# Altium project PCB_Project.PrjPcb
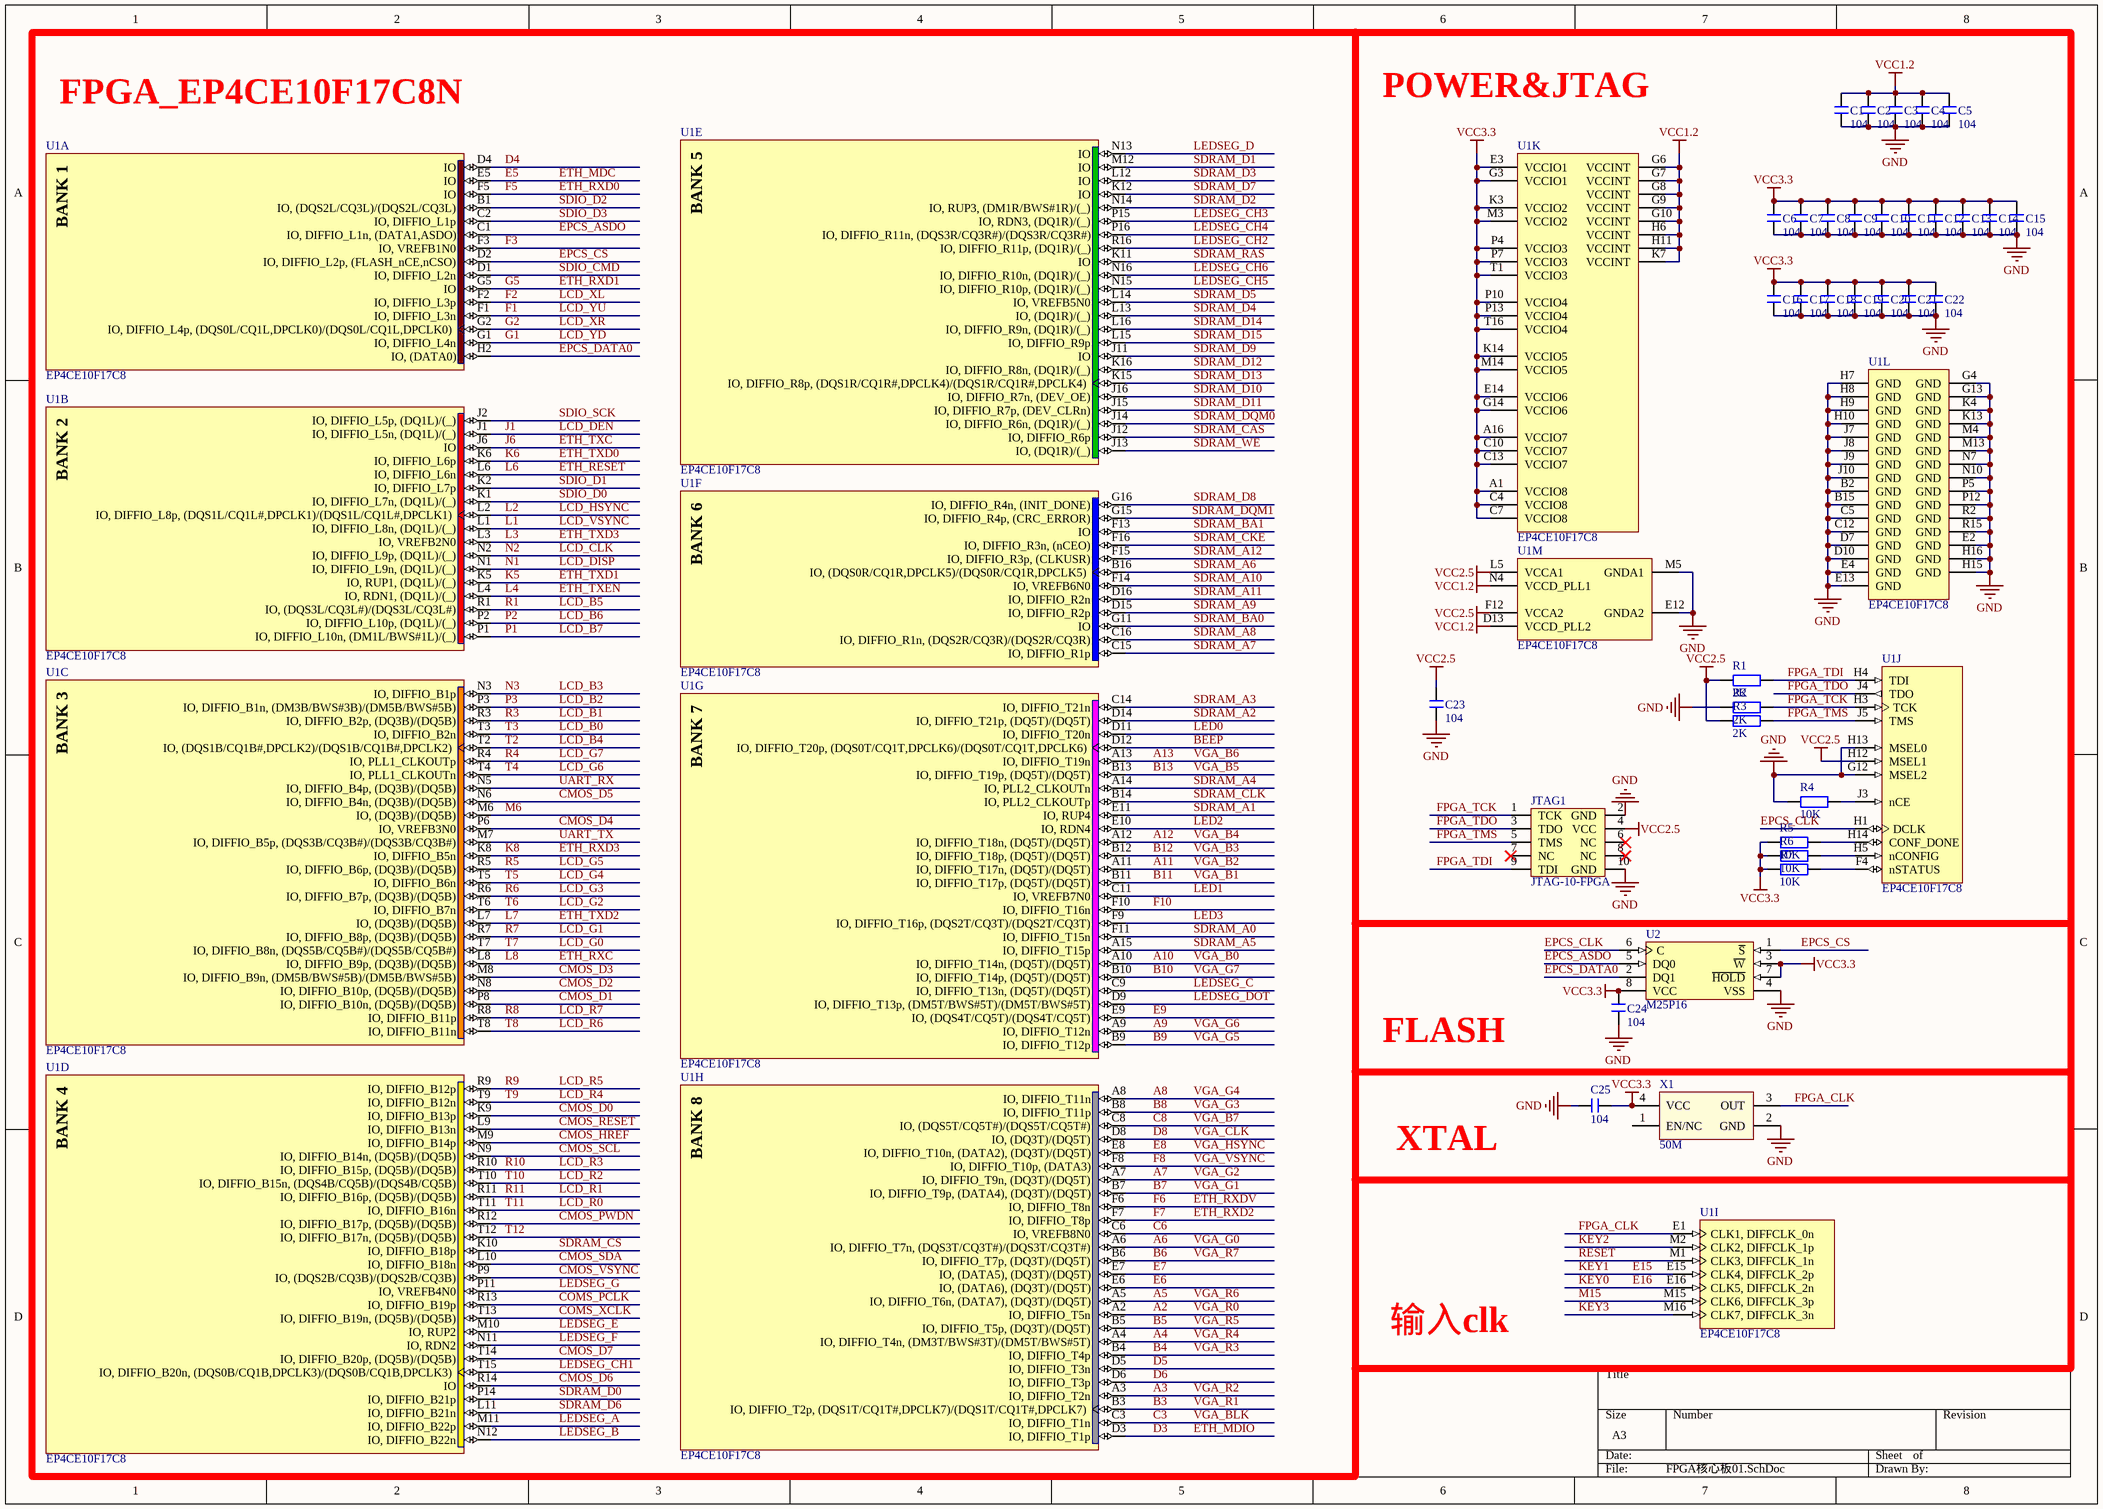
[diagram p0: FPGA核心板01.SchDoc]
4 sheets, 169 parts. Net scope: global (net labels, ports and power ports of the same name join across sheets).
Board file: FPGA核心板.PcbDoc
Sheets:
  FPGA核心板01.SchDoc
  FPGA核心板02.SchDoc
  FPGA核心板03.SchDoc
  FPGA核心板04.SchDoc

## Sheet FPGA核心板01.SchDoc
size A3

### Parts
C1  104  [C 0603_L]
C2  104  [C 0603_L]
C3  104  [C 0603_L]
C4  104  [C 0603_L]
C5  104  [C 0603_L]
C6  104  [C 0603_L]
C7  104  [C 0603_L]
C8  104  [C 0603_L]
C9  104  [C 0603_L]
C10  104  [C 0603_L]
C11  104  [C 0603_L]
C12  104  [C 0603_L]
C13  104  [C 0603_L]
C14  104  [C 0603_L]
C15  104  [C 0603_L]
C16  104  [C 0603_L]
C17  104  [C 0603_L]
C18  104  [C 0603_L]
C19  104  [C 0603_L]
C20  104  [C 0603_L]
C21  104  [C 0603_L]
C22  104  [C 0603_L]
C23  104  [C 0603_L]
C24  104  [C 0603_L]
C25  104  [C 0603_L]
JTAG1  JTAG-10-FPGA  [JTAG_10_2.54]
R1  2K  [R 0603_L]
R2  2K  [R 0603_L]
R3  2K  [R 0603_L]
R4  10K  [R 0603_L]
R5  10K  [R 0603_L]
R6  10K  [R 0603_L]
R7  10K  [R 0603_L]
U1  EP4CE10F17C8  [FBGA256]  (parts A,B,C,D,E,F,G,H,I,J,K,L,M of 13)
U2  M25P16  [sop-8]
X1  50M  [OSC 3225-4P]

### Nets
GND: C1.1 C2.1 C3.1 C4.1 C5.1 C6.1 C7.1 C8.1 C9.1 C10.1 C11.1 C12.1 C13.1 C14.1 C15.1 C16.1 C17.1 C18.1 C19.1 C20.1 C21.1 C22.1 C23.1 C24.1 C25.2 JTAG1.2(GND) JTAG1.10(GND) R2.1 R4.1 U1.B2(GND) U1.B15(GND) U1.C5(GND) U1.C12(GND) U1.D7(GND) U1.D10(GND) U1.E2(GND) U1.E4(GND) U1.E12(GNDA2) U1.E13(GND) U1.G4(GND) U1.G12(MSEL2) U1.G13(GND) U1.H7(GND) U1.H8(GND) U1.H9(GND) U1.H10(GND) U1.H13(MSEL0) U1.H15(GND) U1.H16(GND) U1.J7(GND) U1.J8(GND) U1.J9(GND) U1.J10(GND) U1.K4(GND) U1.K13(GND) U1.M4(GND) U1.M5(GNDA1) U1.M13(GND) U1.N7(GND) U1.N10(GND) U1.P5(GND) U1.P12(GND) U1.R2(GND) U1.R15(GND) U2.4(VSS) X1.2(GND)
VCC1.2: C1.2 C2.2 C3.2 C4.2 C5.2 U1.D13(VCCD_PLL2) U1.G6(VCCINT) U1.G7(VCCINT) U1.G8(VCCINT) U1.G9(VCCINT) U1.G10(VCCINT) U1.H6(VCCINT) U1.H11(VCCINT) U1.K7(VCCINT) U1.N4(VCCD_PLL1)
VCC2.5: C23.2 JTAG1.4(VCC) R1.1 R3.1 U1.F12(VCCA2) U1.H12(MSEL1) U1.L5(VCCA1)
VCC3.3: C6.2 C7.2 C8.2 C9.2 C10.2 C11.2 C12.2 C13.2 C14.2 C15.2 C16.2 C17.2 C18.2 C19.2 C20.2 C21.2 C22.2 C24.2 C25.1 R5.1 R6.1 R7.1 U1.A1(VCCIO8) U1.A16(VCCIO7) U1.C4(VCCIO8) U1.C7(VCCIO8) U1.C10(VCCIO7) U1.C13(VCCIO7) U1.E3(VCCIO1) U1.E14(VCCIO6) U1.G3(VCCIO1) U1.G14(VCCIO6) U1.K3(VCCIO2) U1.K14(VCCIO5) U1.M3(VCCIO2) U1.M14(VCCIO5) U1.P4(VCCIO3) U1.P7(VCCIO3) U1.P10(VCCIO4) U1.P13(VCCIO4) U1.T1(VCCIO3) U1.T16(VCCIO4) U2.3(~{W}) U2.7(~{HOLD}) U2.8(VCC) X1.4(VCC)
A2: U1.A2(IO,_DIFFIO_T5n)  [also labelled VGA_R0]
A3: U1.A3(IO,_DIFFIO_T2n)  [also labelled VGA_R2]
A4: U1.A4(IO,_DIFFIO_T4n,_(DM3T/BWS#3T)/(DM5T/BWS#5T))  [also labelled VGA_R4]
A5: U1.A5(IO,_DIFFIO_T6n,_(DATA7),_(DQ3T)/(DQ5T))  [also labelled VGA_R6]
A6: U1.A6(IO,_DIFFIO_T7n,_(DQS3T/CQ3T#)/(DQS3T/CQ3T#))  [also labelled VGA_G0]
A7: U1.A7(IO,_DIFFIO_T9n,_(DQ3T)/(DQ5T))  [also labelled VGA_G2]
A8: U1.A8(IO,_DIFFIO_T11n)  [also labelled VGA_G4]
A9: U1.A9(IO,_DIFFIO_T12n)  [also labelled VGA_G6]
A10: U1.A10(IO,_DIFFIO_T14n,_(DQ5T)/(DQ5T))  [also labelled VGA_B0]
A11: U1.A11(IO,_DIFFIO_T17n,_(DQ5T)/(DQ5T))  [also labelled VGA_B2]
A12: U1.A12(IO,_DIFFIO_T18n,_(DQ5T)/(DQ5T))  [also labelled VGA_B4]
A13: U1.A13(IO,_DIFFIO_T19n)  [also labelled VGA_B6]
B3: U1.B3(IO,_DIFFIO_T2p,_(DQS1T/CQ1T#,DPCLK7)/(DQS1T/CQ1T#,DPCLK7))  [also labelled VGA_R1]
B4: U1.B4(IO,_DIFFIO_T4p)  [also labelled VGA_R3]
B5: U1.B5(IO,_DIFFIO_T5p,_(DQ3T)/(DQ5T))  [also labelled VGA_R5]
B6: U1.B6(IO,_DIFFIO_T7p,_(DQ3T)/(DQ5T))  [also labelled VGA_R7]
B7: U1.B7(IO,_DIFFIO_T9p,_(DATA4),_(DQ3T)/(DQ5T))  [also labelled VGA_G1]
B8: U1.B8(IO,_DIFFIO_T11p)  [also labelled VGA_G3]
B9: U1.B9(IO,_DIFFIO_T12p)  [also labelled VGA_G5]
B10: U1.B10(IO,_DIFFIO_T14p,_(DQ5T)/(DQ5T))  [also labelled VGA_G7]
B11: U1.B11(IO,_DIFFIO_T17p,_(DQ5T)/(DQ5T))  [also labelled VGA_B1]
B12: U1.B12(IO,_DIFFIO_T18p,_(DQ5T)/(DQ5T))  [also labelled VGA_B3]
B13: U1.B13(IO,_DIFFIO_T19p,_(DQ5T)/(DQ5T))  [also labelled VGA_B5]
BEEP: U1.D12(IO,_DIFFIO_T20p,_(DQS0T/CQ1T,DPCLK6)/(DQS0T/CQ1T,DPCLK6))
C3: U1.C3(IO,_DIFFIO_T1n)  [also labelled VGA_BLK]
C6: U1.C6(IO,_VREFB8N0)
C8: U1.C8(IO,_(DQS5T/CQ5T#)/(DQS5T/CQ5T#))  [also labelled VGA_B7]
CMOS_D0: U1.K9(IO,_DIFFIO_B13p)
CMOS_D1: U1.P8(IO,_DIFFIO_B10n,_(DQ5B)/(DQ5B))
CMOS_D2: U1.N8(IO,_DIFFIO_B10p,_(DQ5B)/(DQ5B))
CMOS_D3: U1.M8(IO,_DIFFIO_B9n,_(DM5B/BWS#5B)/(DM5B/BWS#5B))
CMOS_D4: U1.P6(IO,_VREFB3N0)
CMOS_D5: U1.N6(IO,_DIFFIO_B4n,_(DQ3B)/(DQ5B))
CMOS_D6: U1.R14(IO)
CMOS_D7: U1.T14(IO,_DIFFIO_B20p,_(DQ5B)/(DQ5B))
CMOS_HREF: U1.M9(IO,_DIFFIO_B14p)
CMOS_PWDN: U1.R12(IO,_DIFFIO_B17p,_(DQ5B)/(DQ5B))
CMOS_RESET: U1.L9(IO,_DIFFIO_B13n)
CMOS_SCL: U1.N9(IO,_DIFFIO_B14n,_(DQ5B)/(DQ5B))
CMOS_SDA: U1.L10(IO,_DIFFIO_B18n)
CMOS_VSYNC: U1.P9(IO,_(DQS2B/CQ3B)/(DQS2B/CQ3B))
COMS_PCLK: U1.R13(IO,_DIFFIO_B19p)
COMS_XCLK: U1.T13(IO,_DIFFIO_B19n,_(DQ5B)/(DQ5B))
D3: U1.D3(IO,_DIFFIO_T1p)  [also labelled ETH_MDIO]
D4: U1.D4(IO)
D5: U1.D5(IO,_DIFFIO_T3n)
D6: U1.D6(IO,_DIFFIO_T3p)
D8: U1.D8(IO,_(DQ3T)/(DQ5T))  [also labelled VGA_CLK]
E5: U1.E5(IO)  [also labelled ETH_MDC]
E6: U1.E6(IO,_(DATA6),_(DQ3T)/(DQ5T))
E7: U1.E7(IO,_(DATA5),_(DQ3T)/(DQ5T))
E8: U1.E8(IO,_DIFFIO_T10n,_(DATA2),_(DQ3T)/(DQ5T))  [also labelled VGA_HSYNC]
E9: U1.E9(IO,_(DQS4T/CQ5T)/(DQS4T/CQ5T))
E15: U1.E15(CLK4,_DIFFCLK_2p)  [also labelled KEY1]
E16: U1.E16(CLK5,_DIFFCLK_2n)  [also labelled KEY0]
EPCS_ASDO: U1.C1(IO,_DIFFIO_L1n,_(DATA1,ASDO)) U2.5(DQ0)
EPCS_CLK: U1.H1(DCLK) U2.6(C)
EPCS_CS: U1.D2(IO,_DIFFIO_L2p,_(FLASH_nCE,nCSO)) U2.1(~{S})
EPCS_DATA0: U1.H2(IO,_(DATA0)) U2.2(DQ1)
ETH_RESET: U1.L6(IO,_DIFFIO_L6n)  [also labelled L6]
ETH_RXC: U1.L8(IO,_DIFFIO_B9p,_(DQ3B)/(DQ5B))  [also labelled L8]
ETH_RXD0: U1.F5(IO)  [also labelled F5]
ETH_RXD1: U1.G5(IO)  [also labelled G5]
ETH_RXD2: U1.F7(IO,_DIFFIO_T8p)  [also labelled F7]
ETH_RXD3: U1.K8(IO,_DIFFIO_B5n)  [also labelled K8]
ETH_RXDV: U1.F6(IO,_DIFFIO_T8n)  [also labelled F6]
ETH_TXC: U1.J6(IO)  [also labelled J6]
ETH_TXD0: U1.K6(IO,_DIFFIO_L6p)  [also labelled K6]
ETH_TXD1: U1.K5(IO,_RUP1,_(DQ1L)/(_))  [also labelled K5]
ETH_TXD2: U1.L7(IO,_(DQ3B)/(DQ5B))  [also labelled L7]
ETH_TXD3: U1.L3(IO,_VREFB2N0)  [also labelled L3]
ETH_TXEN: U1.L4(IO,_RDN1,_(DQ1L)/(_))  [also labelled L4]
F1: U1.F1(IO,_DIFFIO_L3n)  [also labelled LCD_YU]
F2: U1.F2(IO,_DIFFIO_L3p)  [also labelled LCD_XL]
F3: U1.F3(IO,_VREFB1N0)
F8: U1.F8(IO,_DIFFIO_T10p,_(DATA3))  [also labelled VGA_VSYNC]
F10: U1.F10(IO,_DIFFIO_T16n)
FPGA_CLK: U1.E1(CLK1,_DIFFCLK_0n) X1.3(OUT)
FPGA_TCK: JTAG1.1(TCK) R2.2 U1.H3(TCK)
FPGA_TDI: JTAG1.9(TDI) R1.2 U1.H4(TDI)
FPGA_TDO: JTAG1.3(TDO) U1.J4(TDO)
FPGA_TMS: JTAG1.5(TMS) R3.2 U1.J5(TMS)
G1: U1.G1(IO,_DIFFIO_L4n)  [also labelled LCD_YD]
G2: U1.G2(IO,_DIFFIO_L4p,_(DQS0L/CQ1L,DPCLK0)/(DQS0L/CQ1L,DPCLK0))  [also labelled LCD_XR]
J1: U1.J1(IO,_DIFFIO_L5n,_(DQ1L)/(_))  [also labelled LCD_DEN]
KEY2: U1.M2(CLK2,_DIFFCLK_1p)
KEY3: U1.M16(CLK7,_DIFFCLK_3n)
L1: U1.L1(IO,_DIFFIO_L8n,_(DQ1L)/(_))  [also labelled LCD_VSYNC]
L2: U1.L2(IO,_DIFFIO_L8p,_(DQS1L/CQ1L#,DPCLK1)/(DQS1L/CQ1L#,DPCLK1))  [also labelled LCD_HSYNC]
LCD_B0: U1.T3(IO,_DIFFIO_B2n)  [also labelled T3]
LCD_B1: U1.R3(IO,_DIFFIO_B2p,_(DQ3B)/(DQ5B))  [also labelled R3]
LCD_B2: U1.P3(IO,_DIFFIO_B1n,_(DM3B/BWS#3B)/(DM5B/BWS#5B))  [also labelled P3]
LCD_B3: U1.N3(IO,_DIFFIO_B1p)  [also labelled N3]
LCD_B4: U1.T2(IO,_(DQS1B/CQ1B#,DPCLK2)/(DQS1B/CQ1B#,DPCLK2))  [also labelled T2]
LCD_B5: U1.R1(IO,_(DQS3L/CQ3L#)/(DQS3L/CQ3L#))  [also labelled R1]
LCD_B6: U1.P2(IO,_DIFFIO_L10p,_(DQ1L)/(_))  [also labelled P2]
LCD_B7: U1.P1(IO,_DIFFIO_L10n,_(DM1L/BWS#1L)/(_))  [also labelled P1]
LCD_CLK: U1.N2(IO,_DIFFIO_L9p,_(DQ1L)/(_))  [also labelled N2]
LCD_DISP: U1.N1(IO,_DIFFIO_L9n,_(DQ1L)/(_))  [also labelled N1]
LCD_G0: U1.T7(IO,_DIFFIO_B8n,_(DQS5B/CQ5B#)/(DQS5B/CQ5B#))  [also labelled T7]
LCD_G1: U1.R7(IO,_DIFFIO_B8p,_(DQ3B)/(DQ5B))  [also labelled R7]
LCD_G2: U1.T6(IO,_DIFFIO_B7n)  [also labelled T6]
LCD_G3: U1.R6(IO,_DIFFIO_B7p,_(DQ3B)/(DQ5B))  [also labelled R6]
LCD_G4: U1.T5(IO,_DIFFIO_B6n)  [also labelled T5]
LCD_G5: U1.R5(IO,_DIFFIO_B6p,_(DQ3B)/(DQ5B))  [also labelled R5]
LCD_G6: U1.T4(IO,_PLL1_CLKOUTn)  [also labelled T4]
LCD_G7: U1.R4(IO,_PLL1_CLKOUTp)  [also labelled R4]
LCD_R0: U1.T11(IO,_DIFFIO_B16n)  [also labelled T11]
LCD_R1: U1.R11(IO,_DIFFIO_B16p,_(DQ5B)/(DQ5B))  [also labelled R11]
LCD_R2: U1.T10(IO,_DIFFIO_B15n,_(DQS4B/CQ5B)/(DQS4B/CQ5B))  [also labelled T10]
LCD_R3: U1.R10(IO,_DIFFIO_B15p,_(DQ5B)/(DQ5B))  [also labelled R10]
LCD_R4: U1.T9(IO,_DIFFIO_B12n)  [also labelled T9]
LCD_R5: U1.R9(IO,_DIFFIO_B12p)  [also labelled R9]
LCD_R6: U1.T8(IO,_DIFFIO_B11n)  [also labelled T8]
LCD_R7: U1.R8(IO,_DIFFIO_B11p)  [also labelled R8]
LED0: U1.D11(IO,_DIFFIO_T20n)
LED1: U1.C11(IO,_VREFB7N0)
LED2: U1.E10(IO,_RDN4)
LED3: U1.F9(IO,_DIFFIO_T16p,_(DQS2T/CQ3T)/(DQS2T/CQ3T))
LEDSEG_A: U1.M11(IO,_DIFFIO_B22p)
LEDSEG_B: U1.N12(IO,_DIFFIO_B22n)
LEDSEG_C: U1.C9(IO,_DIFFIO_T13n,_(DQ5T)/(DQ5T))
LEDSEG_CH1: U1.T15(IO,_DIFFIO_B20n,_(DQS0B/CQ1B,DPCLK3)/(DQS0B/CQ1B,DPCLK3))
LEDSEG_CH2: U1.R16(IO,_DIFFIO_R11p,_(DQ1R)/(_))
LEDSEG_CH3: U1.P15(IO,_RDN3,_(DQ1R)/(_))
LEDSEG_CH4: U1.P16(IO,_DIFFIO_R11n,_(DQS3R/CQ3R#)/(DQS3R/CQ3R#))
LEDSEG_CH5: U1.N15(IO,_DIFFIO_R10p,_(DQ1R)/(_))
LEDSEG_CH6: U1.N16(IO,_DIFFIO_R10n,_(DQ1R)/(_))
LEDSEG_D: U1.N13(IO)
LEDSEG_DOT: U1.D9(IO,_DIFFIO_T13p,_(DM5T/BWS#5T)/(DM5T/BWS#5T))
LEDSEG_E: U1.M10(IO,_RUP2)
LEDSEG_F: U1.N11(IO,_RDN2)
LEDSEG_G: U1.P11(IO,_VREFB4N0)
M6: U1.M6(IO,_(DQ3B)/(DQ5B))
M15: U1.M15(CLK6,_DIFFCLK_3p)
RESET: U1.M1(CLK3,_DIFFCLK_1n)
SDIO_CMD: U1.D1(IO,_DIFFIO_L2n)
SDIO_D0: U1.K1(IO,_DIFFIO_L7n,_(DQ1L)/(_))
SDIO_D1: U1.K2(IO,_DIFFIO_L7p)
SDIO_D2: U1.B1(IO,_(DQS2L/CQ3L)/(DQS2L/CQ3L))
SDIO_D3: U1.C2(IO,_DIFFIO_L1p)
SDIO_SCK: U1.J2(IO,_DIFFIO_L5p,_(DQ1L)/(_))
SDRAM_A0: U1.F11(IO,_DIFFIO_T15n)
SDRAM_A1: U1.E11(IO,_RUP4)
SDRAM_A2: U1.D14(IO,_DIFFIO_T21p,_(DQ5T)/(DQ5T))
SDRAM_A3: U1.C14(IO,_DIFFIO_T21n)
SDRAM_A4: U1.A14(IO,_PLL2_CLKOUTn)
SDRAM_A5: U1.A15(IO,_DIFFIO_T15p)
SDRAM_A6: U1.B16(IO,_(DQS0R/CQ1R,DPCLK5)/(DQS0R/CQ1R,DPCLK5))
SDRAM_A7: U1.C15(IO,_DIFFIO_R1p)
SDRAM_A8: U1.C16(IO,_DIFFIO_R1n,_(DQS2R/CQ3R)/(DQS2R/CQ3R))
SDRAM_A9: U1.D15(IO,_DIFFIO_R2p)
SDRAM_A10: U1.F14(IO,_VREFB6N0)
SDRAM_A11: U1.D16(IO,_DIFFIO_R2n)
SDRAM_A12: U1.F15(IO,_DIFFIO_R3p,_(CLKUSR))
SDRAM_BA0: U1.G11(IO)
SDRAM_BA1: U1.F13(IO)
SDRAM_CAS: U1.J12(IO,_DIFFIO_R6p)
SDRAM_CKE: U1.F16(IO,_DIFFIO_R3n,_(nCEO))
SDRAM_CLK: U1.B14(IO,_PLL2_CLKOUTp)
SDRAM_CS: U1.K10(IO,_DIFFIO_B18p)
SDRAM_D0: U1.P14(IO,_DIFFIO_B21p)
SDRAM_D1: U1.M12(IO)
SDRAM_D2: U1.N14(IO,_RUP3,_(DM1R/BWS#1R)/(_))
SDRAM_D3: U1.L12(IO)
SDRAM_D4: U1.L13(IO,_(DQ1R)/(_))
SDRAM_D5: U1.L14(IO,_VREFB5N0)
SDRAM_D6: U1.L11(IO,_DIFFIO_B21n)
SDRAM_D7: U1.K12(IO)
SDRAM_D8: U1.G16(IO,_DIFFIO_R4n,_(INIT_DONE))
SDRAM_D9: U1.J11(IO)
SDRAM_D10: U1.J16(IO,_DIFFIO_R7n,_(DEV_OE))
SDRAM_D11: U1.J15(IO,_DIFFIO_R7p,_(DEV_CLRn))
SDRAM_D12: U1.K16(IO,_DIFFIO_R8n,_(DQ1R)/(_))
SDRAM_D13: U1.K15(IO,_DIFFIO_R8p,_(DQS1R/CQ1R#,DPCLK4)/(DQS1R/CQ1R#,DPCLK4))
SDRAM_D14: U1.L16(IO,_DIFFIO_R9n,_(DQ1R)/(_))
SDRAM_D15: U1.L15(IO,_DIFFIO_R9p)
SDRAM_DQM0: U1.J14(IO,_DIFFIO_R6n,_(DQ1R)/(_))
SDRAM_DQM1: U1.G15(IO,_DIFFIO_R4p,_(CRC_ERROR))
SDRAM_RAS: U1.K11(IO)
SDRAM_WE: U1.J13(IO,_(DQ1R)/(_))
T12: U1.T12(IO,_DIFFIO_B17n,_(DQ5B)/(DQ5B))
UART_RX: U1.N5(IO,_DIFFIO_B4p,_(DQ3B)/(DQ5B))
UART_TX: U1.M7(IO,_DIFFIO_B5p,_(DQS3B/CQ3B#)/(DQS3B/CQ3B#))
NetR4_2: R4.2 U1.J3(nCE)
NetR5_2: R5.2 U1.H14(CONF_DONE)
NetR6_2: R6.2 U1.H5(nCONFIG)
NetR7_2: R7.2 U1.F4(nSTATUS)

Not connected (* = marked no-connect by the designer): JTAG1 6(NC)* 7(NC)* 8(NC)*; X1 1(EN/NC)

### Notes on the sheet
- FPGA_EP4CE10F17C8N
- POWER&JTAG
- FLASH
- XTAL
- 输入clk
- (in symbol EP4CE6F17C8, part A) BANK 1
- (in symbol EP4CE6F17C8, part B) BANK 2
- (in symbol EP4CE6F17C8, part C) BANK 3
- (in symbol EP4CE6F17C8, part D) BANK 4
- (in symbol EP4CE6F17C8, part E) BANK 5
- (in symbol EP4CE6F17C8, part F) BANK 6
- (in symbol EP4CE6F17C8, part G) BANK 7
- (in symbol EP4CE6F17C8, part H) BANK 8

### Library data of the parts
C1-C25 = C: 贴片电容; BOM名称: 无极性贴片电容; 淘宝ID: 封装库来自淘宝 ID：黄晶宝石; 联系售后: https://shop463601444.taobao.com
R1-R7 = R: 贴片电阻; 版权归属: 来自淘宝 ID：黄晶宝石; BOM名称: 贴片电阻; 联系售后: https://shop463601444.taobao.com
U1 = EP4CE6F17C8: Cyclone IV Family FPGA, 2V Core, 179 I/O Pins, 2 PLLs, 256-Pin FBGA, Speed Grade 8, Commercial Grade; Published: 3-May-2010; DatasheetVersion: ver1.2, Mar-2010; PackageVersion: ver16.0, Dec-2009; PackageReference: FBGA256; Publisher: Altium Limited; PackageDescription: 256-Ball FineLine Ball Grid Array (FBGA256) - Option 1 - Wire Bond; Supplier 1: Digi-Key; Supplier Part Number 1: EP4CE6F17C8-ND; Code_JEDEC: MS-034-AAF-1; Code_IPC: BGA100P16X16-256; ComponentLink1Description: Manufacturer Link; ComponentLink1URL: http://www.altera.com/; ComponentLink2Description: Handbook; ComponentLink2URL: http://www.altera.com/literature/hb/cyclone-iv/cyclone4-handbook.pdf; ComponentLink3Description: Pinout Specification; ComponentLink3URL: http://www.altera.com/literature/lit-dp.jsp?category=cyc%204&showspreadsheet=y; ComponentLink4Description: Packaging Specification; ComponentLink4URL: http://www.altera.com/literature/ds/dspkg.pdf
U2 = M25P16: 16 Mb (x1) Automotive Serial NOR Flash Memory, 75 MHz, 2.7 to 3.6 V, 8-pin SO8; Part Family: M25P爭ISHIDDEN=T|; Manufacturer: Micron; PartNumber: M25P16-VMN3PB; Density: 16Mb爭ISHIDDEN=T|; Speed: 75 MHz爭ISHIDDEN=T|; Voltage: 2.7V-3.6V爭ISHIDDEN=T|; DatasheetVersion: Rev. Y; PackageVersion: Rev 11; PackageReference: MICT-MN-8; PackageDescription: 8-Pin SO Narrow, 3.9 X 4.9 mm, Pitch 1.27 mm; Applications: Automotive爭ISHIDDEN=T|; Package: SO8 Narrow爭ISHIDDEN=T|; Part Status: Production爭ISHIDDEN=T|; RoHS: Yes爭ISHIDDEN=T|; Type: Data Storage爭ISHIDDEN=T|; Width: x1爭ISHIDDEN=T|; Mounting Technology: Surface Mount; ComponentLink1Description: Manufacturer URL; ComponentLink1URL: http://www.micron.com/; ComponentLink2Description: Datasheet; ComponentLink2URL: http://www.micron.com/~/media/Documents/Products/Data%20Sheet/NOR%20Flash/Serial%20NOR/M25P/M25P16.pdf; ComponentLink3Description: Package Specification; ComponentLink3URL: http://www.micron.com/~/media/Documents/Products/Data%20Sheet/NOR%20Flash/Serial%20NOR/M25P/M25P05A.pdf
X1 = XTAL-ACT-4P: 4脚有源晶振; 版权归属: 源创客; BOM名称: 4脚有源晶振; 学习资源: www.ooocke.com

## Sheet FPGA核心板02.SchDoc
size A4
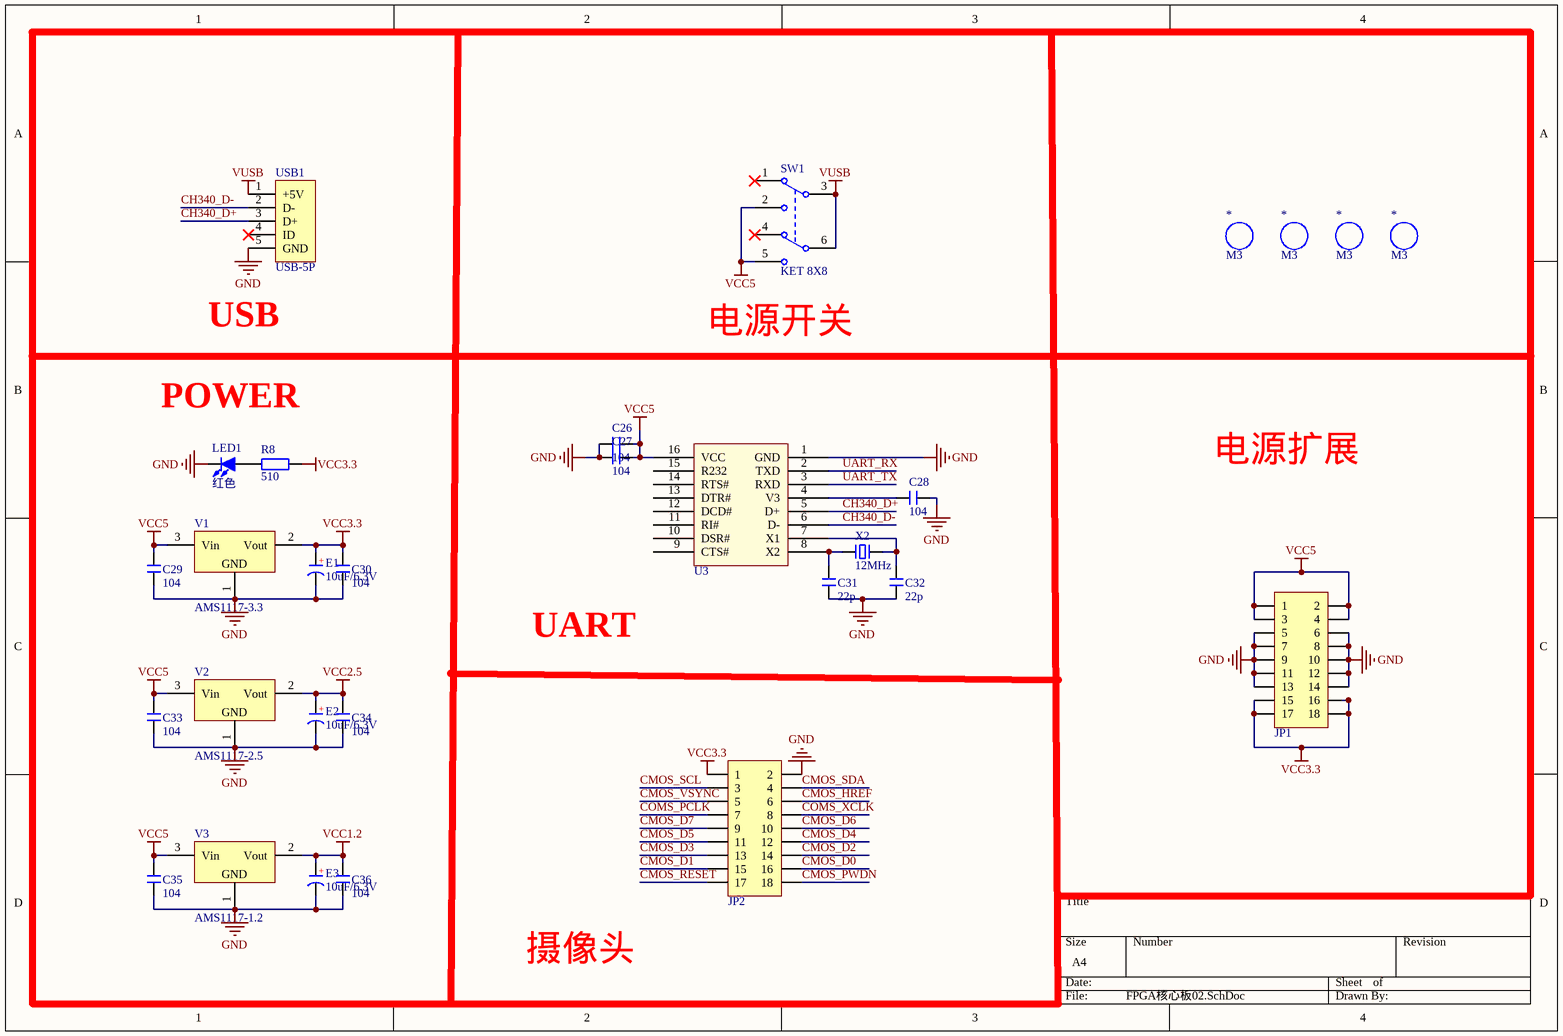
[diagram p1: FPGA核心板02.SchDoc]

### Parts
(Parts that share a designator on the sheet are numbered #1, #2 ... from top to bottom, then left to right.)
*#1  M3  [M3 125X300]
*#2  M3  [M3 125X300]
*#3  M3  [M3 125X300]
*#4  M3  [M3 125X300]
C26  104  [C 0603_L]
C27  104  [C 0603_L]
C28  104  [C 0603_L]
C29  104  [C 0603_L]
C30  104  [C 0603_L]
C31  22p  [C 0603_L]
C32  22p  [C 0603_L]
C33  104  [C 0603_L]
C34  104  [C 0603_L]
C35  104  [C 0603_L]
C36  104  [C 0603_L]
E1  10uF/6.3V  [CD A(3216)]
E2  10uF/6.3V  [CD A(3216)]
E3  10uF/6.3V  [CD A(3216)]
JP1  Header 9X2  [HDR2.54-LI-2x9P]  (value not drawn)
JP2  Header 9X2  [HDR2.54-WI-2x9P]  (value not drawn)
LED1  红色  [LED 0805B]
R8  510  [R 0603_L]
SW1  KET 8X8  [KFT DIP-8X8]
U3  CH340G  [sop16_L]  (value not drawn)
USB1  USB-5P  [USB-MICRO_B]
V1  AMS1117-3.3  [SOT223_L]
V2  AMS1117-2.5  [SOT223_L]
V3  AMS1117-1.2  [SOT223_L]
X2  12MHz  [OSC HC-49S]

### Nets
GND: C26.1 C27.1 C28.2 C29.2 C30.2 C31.1 C32.1 C33.2 C34.2 C35.1 C36.1 E1.2(K) E2.2(K) E3.2(K) JP1.5 JP1.6 JP1.7 JP1.8 JP1.9 JP1.10 JP1.11 JP1.12 JP1.13 JP1.14 JP2.2 LED1.2(K) U3.1(GND) USB1.5(GND) V1.1(GND) V2.1(GND) V3.1(GND)
VCC1.2: C36.2 E3.1(A) V3.2(Vout)
VCC2.5: C34.1 E2.1(A) V2.2(Vout)
VCC3.3: C30.1 E1.1(A) JP1.15 JP1.16 JP1.17 JP1.18 JP2.1 R8.2 V1.2(Vout)
VCC5: C26.2 C27.2 C29.1 C33.1 C35.2 JP1.1 JP1.2 JP1.3 JP1.4 SW1.2(COM2) SW1.5(COM2) U3.16(VCC) V1.3(Vin) V2.3(Vin) V3.3(Vin)
VUSB: SW1.3(NO1) SW1.6(NC2) USB1.1(+5V)
CH340_D+: U3.5(D+) USB1.3(D+)
CH340_D-: U3.6(D-) USB1.2(D-)
CMOS_D0: JP2.16
CMOS_D1: JP2.15
CMOS_D2: JP2.14
CMOS_D3: JP2.13
CMOS_D4: JP2.12
CMOS_D5: JP2.11
CMOS_D6: JP2.10
CMOS_D7: JP2.9
CMOS_HREF: JP2.6
CMOS_PWDN: JP2.18
CMOS_RESET: JP2.17
CMOS_SCL: JP2.3
CMOS_SDA: JP2.4
CMOS_VSYNC: JP2.5
COMS_PCLK: JP2.7
COMS_XCLK: JP2.8
UART_RX: U3.2(TXD)
UART_TX: U3.3(RXD)
NetC28_1: C28.1 U3.4(V3)
NetC31_2: C31.2 U3.8(X2) X2.1
NetC32_2: C32.2 U3.7(X1) X2.2
NetLED1_1: LED1.1(A) R8.1

Not connected (* = marked no-connect by the designer): SW1 1(NC1)* 4(NO2)*; U3 9(CTS#) 10(DSR#) 11(RI#) 12(DCD#) 13(DTR#) 14(RTS#) 15(R232); USB1 4(ID)*

### Notes on the sheet
- (near USB1) USB
- (near SW1) 电源开关
- POWER
- 电源扩展
- UART
- 摄像头
- (in symbol CT) +

### Library data of the parts
*#1-*#4 = M3: 铜柱孔; 版权归属: 封装库来自淘宝 ID：黄晶宝石; BOM名称: 铜柱孔; 学习资源: https://shop463601444.taobao.com
C26-C36 = C: as C1 on sheet FPGA核心板01; 联系售后: https://shop463601444.taobao.com
E1-E3 = CT: 贴片钽电容; 淘宝ID: 封装库来自淘宝 ID：黄晶宝石; BOM名称: 贴片钽电容; 联系售后: https://shop463601444.taobao.com
JP1 JP2 = Header 9X2: 9*2P接插件; 版权归属: 源创客; BOM名称: 9*2P接插件; 学习资源: www.ooocke.com
LED1 = LED-SMD: 贴片LED; 版权归属: 封装库来自淘宝 ID：黄晶宝石; BOM名称: 贴片LED; 学习资源: https://shop463601444.taobao.com
R8 = R: 贴片电阻; 版权归属: 来自淘宝 ID：黄晶宝石; BOM名称: 贴片电阻; 联系售后: https://shop463601444.taobao.com
SW1 = KET 8X8: 8*8自锁开关; 版权归属: 封装库来自淘宝 ID：黄晶宝石; BOM名称: 8*8自锁开关; 学习资源: https://shop463601444.taobao.com
USB1 = USB-5P: 微型USB母座; BOM名称: 微型USB母座; 学习资源: https://shop463601444.taobao.com
V1-V3 = AMS1117: 三端稳压芯片; BOM名称: 稳压芯片; 淘宝ID: 封装库来自淘宝 ID：黄晶宝石; 欢迎光临淘宝店铺: https://shop463601444.taobao.com
X2 = XTAL-2P: 2脚无源脚晶振; 版权归属: 源创客; BOM名称: 2脚无源脚晶振; 学习资源: www.ooocke.com

## Sheet FPGA核心板03.SchDoc
size A4
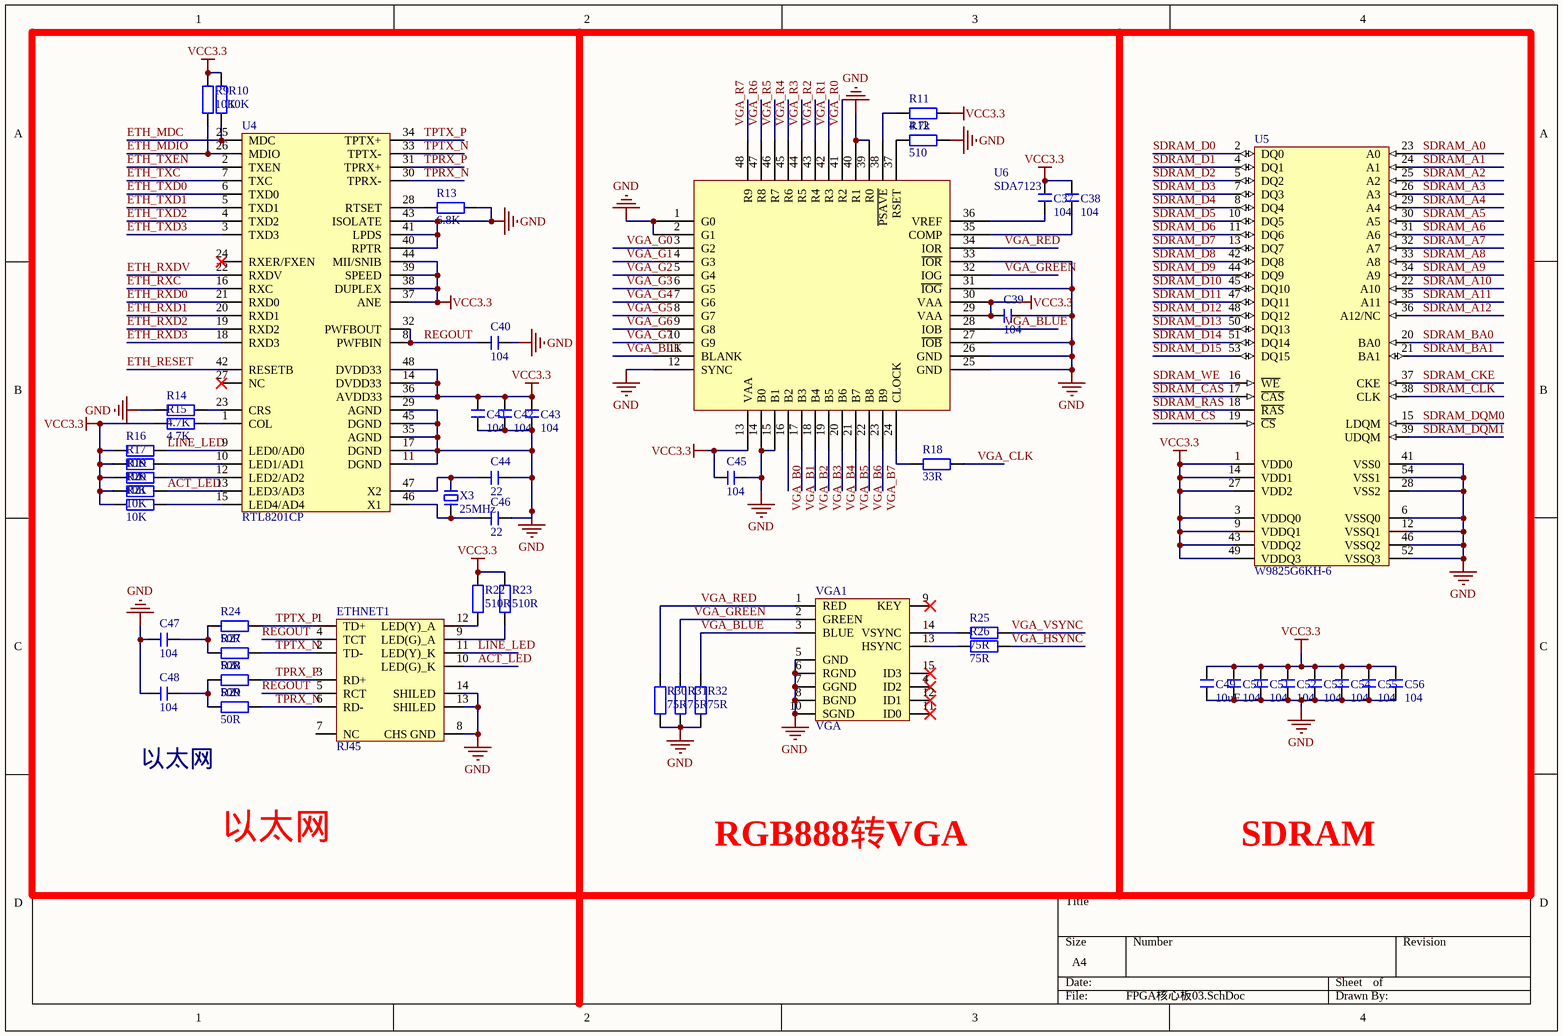
[diagram p2: FPGA核心板03.SchDoc]

### Parts
C37  104  [C 0603_L]
C38  104  [C 0603_L]
C39  104  [C 0603_L]
C40  104  [C 0603_L]
C41  104  [C 0603_L]
C42  104  [C 0603_L]
C43  104  [C 0603_L]
C44  22  [C 0603_L]
C45  104  [C 0603_L]
C46  22  [C 0603_L]
C47  104  [C 0603_L]
C48  104  [C 0603_L]
C49  10uF  [C 0603_L]
C50  104  [C 0603_L]
C51  104  [C 0603_L]
C52  104  [C 0603_L]
C53  104  [C 0603_L]
C54  104  [C 0603_L]
C55  104  [C 0603_L]
C56  104  [C 0603_L]
ETHNET1  RJ45  [RJ-45A12]
R9  10K  [R 0603_L]
R10  10K  [R 0603_L]
R11  4.7k  [R 0603_L]
R12  510  [R 0603_L]
R13  6.8K  [R 0603_L]
R14  4.7K  [R 0603_L]
R15  4.7K  [R 0603_L]
R16  10K  [R 0603_L]
R17  10K  [R 0603_L]
R18  33R  [R 0603_L]
R19  10K  [R 0603_L]
R20  10K  [R 0603_L]
R21  10K  [R 0603_L]
R22  510R  [R 0603_L]
R23  510R  [R 0603_L]
R24  50R  [R 0603_L]
R25  75R  [R 0603_L]
R26  75R  [R 0603_L]
R27  50R  [R 0603_L]
R28  50R  [R 0603_L]
R29  50R  [R 0603_L]
R30  75R  [R 0603_L]
R31  75R  [R 0603_L]
R32  75R  [R 0603_L]
U4  RTL8201CP  [LQFP48 7X7_L]
U5  W9825G6KH-6  [TSOP54]
U6  SDA7123  [LQFP48 7X7_N]
VGA1  VGA  [VGA15B]
X3  25MHz  [OSC HC-49S]

### Nets
GND: C39.1 C40.1 C41.1 C42.1 C43.1 C44.2 C45.2 C46.2 C47.2 C48.2 C49.1 C50.1 C51.1 C52.1 C53.1 C54.1 C55.1 C56.1 ETHNET1.8(CHS_GND) ETHNET1.13(SHILED) ETHNET1.14(SHILED) R12.2 R13.2 R14.1 R30.1 R31.1 R32.1 U4.11(DGND) U4.17(DGND) U4.29(AGND) U4.35(AGND) U4.40(RPTR) U4.41(LPDS) U4.43(ISOLATE) U4.45(DGND) U5.6(VSSQ0) U5.12(VSSQ1) U5.28(VSS2) U5.41(VSS0) U5.46(VSSQ2) U5.52(VSSQ3) U5.54(VSS1) U6.1(G0) U6.2(G1) U6.12(SYNC) U6.14(B0) U6.15(B1) U6.25(GND) U6.26(GND) U6.27(~{IOB}) U6.31(~{IOG}) U6.33(~{IOR}) U6.39(R0) U6.40(R1) VGA1.5(GND) VGA1.6(RGND) VGA1.7(GGND) VGA1.8(BGND) VGA1.10(SGND)
VCC3.3: C37.2 C38.2 C39.2 C41.2 C42.2 C43.2 C45.1 C49.2 C50.2 C51.2 C52.2 C53.2 C54.2 C55.2 C56.2 R9.2 R10.2 R11.2 R15.1 R16.1 R17.1 R19.1 R20.1 R21.1 R22.2 R23.2 U4.14(DVDD33) U4.36(AVDD33) U4.37(ANE) U4.38(DUPLEX) U4.39(SPEED) U4.44(MII/SNIB) U4.48(DVDD33) U5.1(VDD0) U5.3(VDDQ0) U5.9(VDDQ1) U5.14(VDD1) U5.27(VDD2) U5.43(VDDQ2) U5.49(VDDQ3) U6.13(VAA) U6.29(VAA) U6.30(VAA)
ACT_LED: ETHNET1.10(LED(G)_K) R20.2 U4.13(LED3/AD3)
ETH_MDC: R10.1 U4.25(MDC)  [project net E5]
ETH_MDIO: R9.1 U4.26(MDIO)  [project net D3]
ETH_RESET: U4.42(RESETB)
ETH_RXC: U4.16(RXC)
ETH_RXD0: U4.21(RXD0)
ETH_RXD1: U4.20(RXD1)
ETH_RXD2: U4.19(RXD2)
ETH_RXD3: U4.18(RXD3)
ETH_RXDV: U4.22(RXDV)
ETH_TXC: U4.7(TXC)
ETH_TXD0: U4.6(TXD0)
ETH_TXD1: U4.5(TXD1)
ETH_TXD2: U4.4(TXD2)
ETH_TXD3: U4.3(TXD3)
ETH_TXEN: U4.2(TXEN)
LINE_LED: ETHNET1.11(LED(Y)_K) R16.2 U4.9(LED0/AD0)
REGOUT: C40.2 ETHNET1.4(TCT) ETHNET1.5(RCT) U4.8(PWFBIN) U4.32(PWFBOUT)
SDRAM_A0: U5.23(A0)
SDRAM_A1: U5.24(A1)
SDRAM_A2: U5.25(A2)
SDRAM_A3: U5.26(A3)
SDRAM_A4: U5.29(A4)
SDRAM_A5: U5.30(A5)
SDRAM_A6: U5.31(A6)
SDRAM_A7: U5.32(A7)
SDRAM_A8: U5.33(A8)
SDRAM_A9: U5.34(A9)
SDRAM_A10: U5.22(A10)
SDRAM_A11: U5.35(A11)
SDRAM_A12: U5.36(A12/NC)
SDRAM_BA0: U5.20(BA0)
SDRAM_BA1: U5.21(BA1)
SDRAM_CAS: U5.17(~{CAS})
SDRAM_CKE: U5.37(CKE)
SDRAM_CLK: U5.38(CLK)
SDRAM_CS: U5.19(~{CS})
SDRAM_D0: U5.2(DQ0)
SDRAM_D1: U5.4(DQ1)
SDRAM_D2: U5.5(DQ2)
SDRAM_D3: U5.7(DQ3)
SDRAM_D4: U5.8(DQ4)
SDRAM_D5: U5.10(DQ5)
SDRAM_D6: U5.11(DQ6)
SDRAM_D7: U5.13(DQ7)
SDRAM_D8: U5.42(DQ8)
SDRAM_D9: U5.44(DQ9)
SDRAM_D10: U5.45(DQ10)
SDRAM_D11: U5.47(DQ11)
SDRAM_D12: U5.48(DQ12)
SDRAM_D13: U5.50(DQ13)
SDRAM_D14: U5.51(DQ14)
SDRAM_D15: U5.53(DQ15)
SDRAM_DQM0: U5.15(LDQM)
SDRAM_DQM1: U5.39(UDQM)
SDRAM_RAS: U5.18(~{RAS})
SDRAM_WE: U5.16(~{WE})
TPRX_N: ETHNET1.6(RD-) R29.2 U4.30(TPRX-)
TPRX_P: ETHNET1.3(RD+) R28.2 U4.31(TPRX+)
TPTX_N: ETHNET1.2(TD-) R27.2 U4.33(TPTX-)
TPTX_P: ETHNET1.1(TD+) R24.2 U4.34(TPTX+)
VGA_B0: U6.16(B2)  [project net A10]
VGA_B1: U6.17(B3)  [project net B11]
VGA_B2: U6.18(B4)  [project net A11]
VGA_B3: U6.19(B5)  [project net B12]
VGA_B4: U6.20(B6)  [project net A12]
VGA_B5: U6.21(B7)  [project net B13]
VGA_B6: U6.22(B8)  [project net A13]
VGA_B7: U6.23(B9)  [project net C8]
VGA_BLK: U6.11(BLANK)  [project net C3]
VGA_BLUE: R32.2 U6.28(IOB) VGA1.3(BLUE)
VGA_CLK: R18.2  [project net D8]
VGA_G0: U6.3(G2)  [project net A6]
VGA_G1: U6.4(G3)  [project net B7]
VGA_G2: U6.5(G4)  [project net A7]
VGA_G3: U6.6(G5)  [project net B8]
VGA_G4: U6.7(G6)  [project net A8]
VGA_G5: U6.8(G7)  [project net B9]
VGA_G6: U6.9(G8)  [project net A9]
VGA_G7: U6.10(G9)  [project net B10]
VGA_GREEN: R31.2 U6.32(IOG) VGA1.2(GREEN)
VGA_HSYNC: R26.1  [project net E8]
VGA_R0: U6.41(R2)  [project net A2]
VGA_R1: U6.42(R3)  [project net B3]
VGA_R2: U6.43(R4)  [project net A3]
VGA_R3: U6.44(R5)  [project net B4]
VGA_R4: U6.45(R6)  [project net A4]
VGA_R5: U6.46(R7)  [project net B5]
VGA_R6: U6.47(R8)  [project net A5]
VGA_R7: U6.48(R9)  [project net B6]
VGA_RED: R30.2 U6.34(IOR) VGA1.1(RED)
VGA_VSYNC: R25.1  [project net F8]
NetC37_1: C37.1 U6.36(VREF)
NetC38_1: C38.1 U6.35(COMP)
NetC44_1: C44.1 U4.47(X2) X3.2
NetC46_1: C46.1 U4.46(X1) X3.1
NetC47_1: C47.1 R24.1 R27.1
NetC48_1: C48.1 R28.1 R29.1
NetETHNET1_9: ETHNET1.9(LED(G)_A) R23.1
NetETHNET1_12: ETHNET1.12(LED(Y)_A) R22.1
NetR11_1: R11.1 U6.38(~{PSAVE})
NetR12_1: R12.1 U6.37(RSET)
NetR13_1: R13.1 U4.28(RTSET)
NetR14_2: R14.2 U4.23(CRS)
NetR15_2: R15.2 U4.1(COL)
NetR17_2: R17.2 U4.10(LED1/AD1)
NetR18_1: R18.1 U6.24(CLOCK)
NetR19_2: R19.2 U4.12(LED2/AD2)
NetR21_2: R21.2 U4.15(LED4/AD4)
NetR25_2: R25.2 VGA1.14(VSYNC)
NetR26_2: R26.2 VGA1.13(HSYNC)

Not connected (* = marked no-connect by the designer): ETHNET1 7(NC); U4 24(RXER/FXEN)* 27(NC)*; VGA1 4(ID2)* 9(KEY)* 11(ID0)* 12(ID1)* 15(ID3)*

### Notes on the sheet
- 以太网
- RGB888转VGA
- SDRAM

### Library data of the parts
C37-C56 = C: as C1 on sheet FPGA核心板01; 联系售后: https://shop463601444.taobao.com
ETHNET1 = HR911105
R9-R32 = R: 贴片电阻; 版权归属: 来自淘宝 ID：黄晶宝石; BOM名称: 贴片电阻; 联系售后: https://shop463601444.taobao.com
U4 = RTL8201CP: ETH PHY
U5 = IS42S16160B: 32MB SDRAM
X3 = XTAL-2P: 2脚无源脚晶振; 版权归属: 源创客; BOM名称: 2脚无源脚晶振; 学习资源: www.ooocke.com

## Sheet FPGA核心板04.SchDoc
size A4
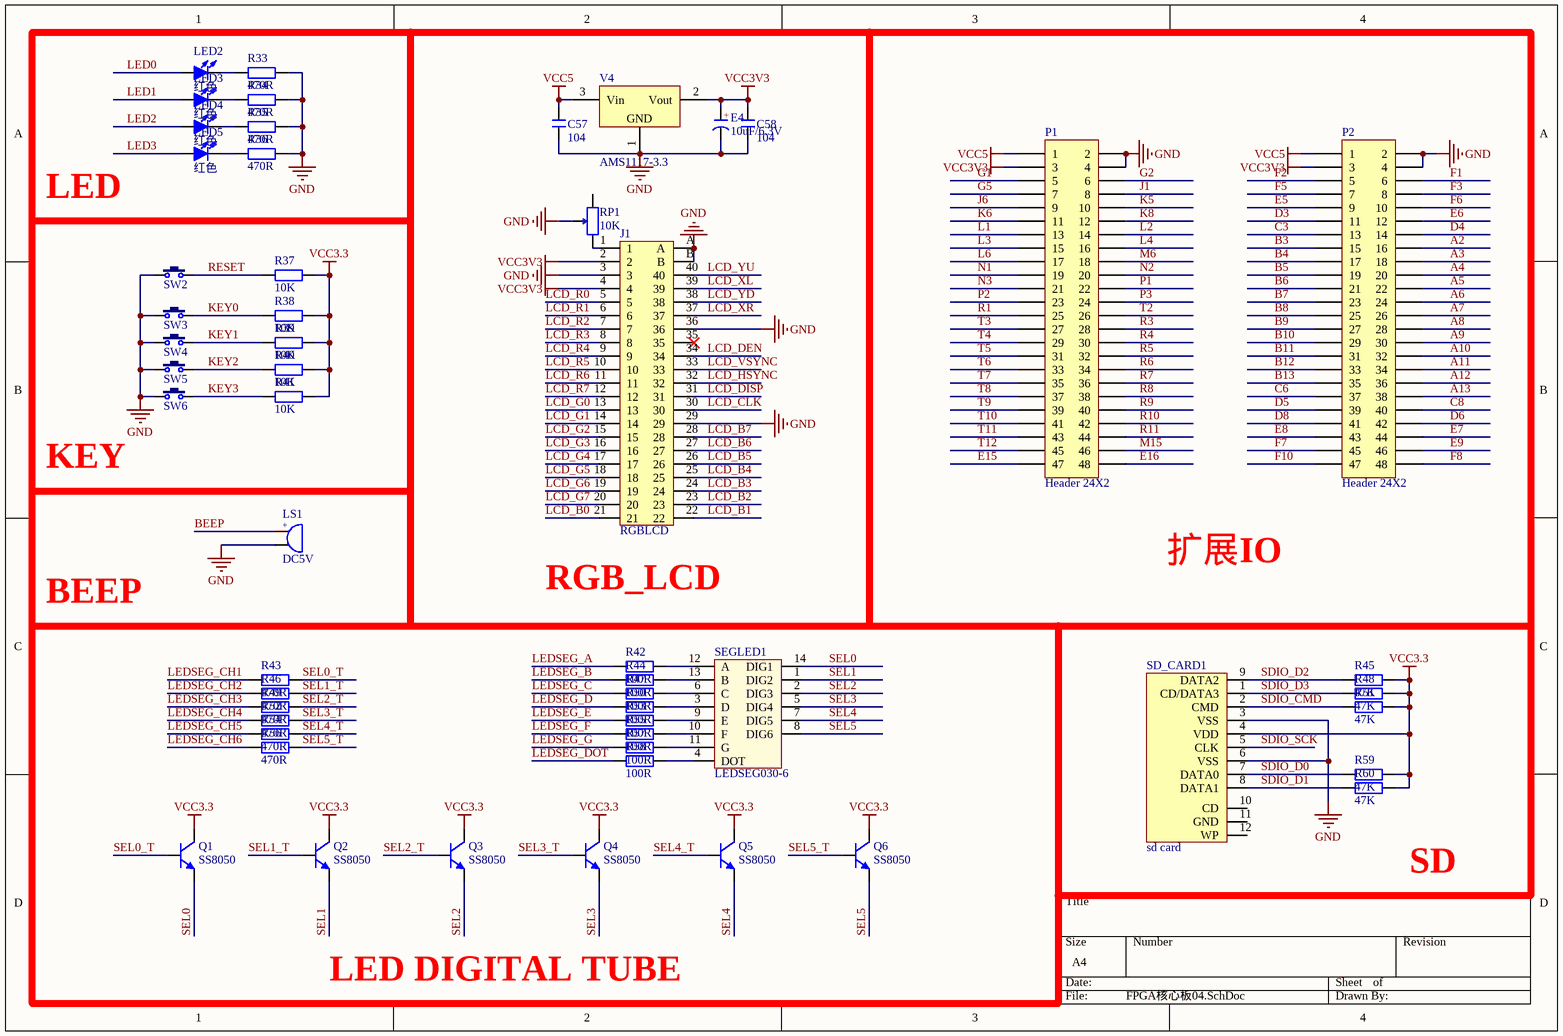
[diagram p3: FPGA核心板04.SchDoc]

### Parts
C57  104  [C 0603_L]
C58  104  [C 0603_L]
E4  10uF/6.3V  [CD A(3216)]
J1  RGBLCD  [FPC-TOP40]
LED2  红色  [LED 0603B]
LED3  红色  [LED 0603B]
LED4  红色  [LED 0603B]
LED5  红色  [LED 0603B]
LS1  DC5V  [BEEP 5x9x5.5]
P1  Header 24X2  [HDR2X24]
P2  Header 24X2  [HDR2X24]
Q1  SS8050  [SOT23-3L]
Q2  SS8050  [SOT23-3L]
Q3  SS8050  [SOT23-3L]
Q4  SS8050  [SOT23-3L]
Q5  SS8050  [SOT23-3L]
Q6  SS8050  [SOT23-3L]
R33  470R  [R 0603_L]
R34  470R  [R 0603_L]
R35  470R  [R 0603_L]
R36  470R  [R 0603_L]
R37  10K  [R 0603_L]
R38  10K  [R 0603_L]
R39  10K  [R 0603_L]
R40  10K  [R 0603_L]
R41  10K  [R 0603_L]
R42  100R  [R 0603_L]
R43  470R  [R 0603_L]
R44  100R  [R 0603_L]
R45  47K  [R 0603_L]
R46  470R  [R 0603_L]
R47  100R  [R 0603_L]
R48  47K  [R 0603_L]
R49  470R  [R 0603_L]
R50  100R  [R 0603_L]
R51  47K  [R 0603_L]
R52  470R  [R 0603_L]
R53  100R  [R 0603_L]
R54  470R  [R 0603_L]
R55  100R  [R 0603_L]
R56  470R  [R 0603_L]
R57  100R  [R 0603_L]
R58  100R  [R 0603_L]
R59  47K  [R 0603_L]
R60  47K  [R 0603_L]
RP1  10K  [RM065]
SD_CARD1  sd card  [SD CARD 全高]
SEGLED1  LEDSEG030-6  [leddisplay-0.3]
SW2  3x6x5  [TSW SMD-3*6*2.5]  (value not drawn)
SW3  3x6x5  [TSW SMD-3*6*2.5]  (value not drawn)
SW4  3x6x5  [TSW SMD-3*6*2.5]  (value not drawn)
SW5  3x6x5  [TSW SMD-3*6*2.5]  (value not drawn)
SW6  3x6x5  [TSW SMD-3*6*2.5]  (value not drawn)
V4  AMS1117-3.3  [SOT223_L]

### Nets
GND: C57.2 C58.2 E4.2(K) J1.3 J1.29 J1.36 J1.A J1.B LS1.2 P1.2 P1.4 P2.2 P2.4 R33.1 R34.1 R35.1 R36.1 RP1.2 SD_CARD1.3(VSS) SD_CARD1.6(VSS) SW2.1 SW3.1 SW4.1 SW5.1 SW6.1 V4.1(GND)
VCC3.3: Q1.3(C) Q2.3(C) Q3.3(C) Q4.3(C) Q5.3(C) Q6.3(C) R37.1 R38.1 R39.1 R40.1 R41.1 R45.1 R48.1 R51.1 R59.1 R60.1 SD_CARD1.4(VDD)
VCC3V3: C58.1 E4.1(A) J1.2 J1.4 P1.3 P2.3 V4.2(Vout)
VCC5: C57.1 P1.1 P2.1 V4.3(Vin)
A2: P2.16
A3: P2.18
A4: P2.20
A5: P2.22
A6: P2.24
A7: P2.26
A8: P2.28
A9: P2.30
A10: P2.32
A11: P2.34
A12: P2.36
A13: P2.38
B3: P2.15
B4: P2.17
B5: P2.19
B6: P2.21
B7: P2.23
B8: P2.25
B9: P2.27
B10: P2.29
B11: P2.31
B12: P2.33
B13: P2.35
BEEP: LS1.1
C3: P2.13
C6: P2.37
C8: P2.40
D3: P2.11
D4: P2.14
D5: P2.39
D6: P2.42
D8: P2.41
E5: P2.9
E6: P2.12
E7: P2.44
E8: P2.43
E9: P2.46
E15: P1.47 R39.2 SW4.2  [also labelled KEY1]
E16: P1.48 R38.2 SW3.2  [also labelled KEY0]
F1: J1.40 P2.6  [also labelled LCD_YU]
F2: J1.39 P2.5  [also labelled LCD_XL]
F3: P2.8
F5: P2.7  [project net ETH_RXD0]
F6: P2.10  [project net ETH_RXDV]
F7: P2.45  [project net ETH_RXD2]
F8: P2.48
F10: P2.47
G1: J1.38 P1.5  [also labelled LCD_YD]
G2: J1.37 P1.6  [also labelled LCD_XR]
G5: P1.7  [project net ETH_RXD1]
J1: J1.34 P1.8  [also labelled LCD_DEN]
J6: P1.9  [project net ETH_TXC]
K5: P1.10  [project net ETH_TXD1]
K6: P1.11  [project net ETH_TXD0]
K8: P1.12  [project net ETH_RXD3]
KEY2: R40.2 SW5.2
KEY3: R41.2 SW6.2
L1: J1.33 P1.13  [also labelled LCD_VSYNC]
L2: J1.32 P1.14  [also labelled LCD_HSYNC]
L3: P1.15  [project net ETH_TXD3]
L4: P1.16  [project net ETH_TXEN]
L6: P1.17  [project net ETH_RESET]
LCD_B0: J1.21 P1.27  [also labelled T3]
LCD_B1: J1.22 P1.28  [also labelled R3]
LCD_B2: J1.23 P1.24  [also labelled P3]
LCD_B3: J1.24 P1.21  [also labelled N3]
LCD_B4: J1.25 P1.26  [also labelled T2]
LCD_B5: J1.26 P1.25  [also labelled R1]
LCD_B6: J1.27 P1.23  [also labelled P2]
LCD_B7: J1.28 P1.22  [also labelled P1]
LCD_CLK: J1.30 P1.20  [also labelled N2]
LCD_DISP: J1.31 P1.19  [also labelled N1]
LCD_G0: J1.13 P1.35  [also labelled T7]
LCD_G1: J1.14 P1.36  [also labelled R7]
LCD_G2: J1.15 P1.33  [also labelled T6]
LCD_G3: J1.16 P1.34  [also labelled R6]
LCD_G4: J1.17 P1.31  [also labelled T5]
LCD_G5: J1.18 P1.32  [also labelled R5]
LCD_G6: J1.19 P1.29  [also labelled T4]
LCD_G7: J1.20 P1.30  [also labelled R4]
LCD_R0: J1.5 P1.43  [also labelled T11]
LCD_R1: J1.6 P1.44  [also labelled R11]
LCD_R2: J1.7 P1.41  [also labelled T10]
LCD_R3: J1.8 P1.42  [also labelled R10]
LCD_R4: J1.9 P1.39  [also labelled T9]
LCD_R5: J1.10 P1.40  [also labelled R9]
LCD_R6: J1.11 P1.37  [also labelled T8]
LCD_R7: J1.12 P1.38  [also labelled R8]
LED0: LED2.1(A)
LED1: LED3.1(A)
LED2: LED4.1(A)
LED3: LED5.1(A)
LEDSEG_A: R42.2
LEDSEG_B: R44.2
LEDSEG_C: R47.2
LEDSEG_CH1: R43.2
LEDSEG_CH2: R46.2
LEDSEG_CH3: R49.2
LEDSEG_CH4: R52.2
LEDSEG_CH5: R54.2
LEDSEG_CH6: R56.2
LEDSEG_D: R50.2
LEDSEG_DOT: R58.2
LEDSEG_E: R53.2
LEDSEG_F: R55.2
LEDSEG_G: R57.2
M6: P1.18
M15: P1.46
RESET: R37.2 SW2.2
SDIO_CMD: R51.2 SD_CARD1.2(CMD)
SDIO_D0: R59.2 SD_CARD1.7(DATA0)
SDIO_D1: R60.2 SD_CARD1.8(DATA1)
SDIO_D2: R45.2 SD_CARD1.9(DATA2)
SDIO_D3: R48.2 SD_CARD1.1(CD/DATA3)
SDIO_SCK: SD_CARD1.5(CLK)
SEL0: Q1.2(E) SEGLED1.14(DIG1)
SEL0_T: Q1.1(B) R43.1
SEL1: Q2.2(E) SEGLED1.1(DIG2)
SEL1_T: Q2.1(B) R46.1
SEL2: Q3.2(E) SEGLED1.2(DIG3)
SEL2_T: Q3.1(B) R49.1
SEL3: Q4.2(E) SEGLED1.5(DIG4)
SEL3_T: Q4.1(B) R52.1
SEL4: Q5.2(E) SEGLED1.7(DIG5)
SEL4_T: Q5.1(B) R54.1
SEL5: Q6.2(E) SEGLED1.8(DIG6)
SEL5_T: Q6.1(B) R56.1
T12: P1.45
NetJ1_1: J1.1 RP1.1
NetLED2_2: LED2.2(K) R33.2
NetLED3_2: LED3.2(K) R34.2
NetLED4_2: LED4.2(K) R35.2
NetLED5_2: LED5.2(K) R36.2
NetR42_1: R42.1 SEGLED1.12(A)
NetR44_1: R44.1 SEGLED1.13(B)
NetR47_1: R47.1 SEGLED1.6(C)
NetR50_1: R50.1 SEGLED1.3(D)
NetR53_1: R53.1 SEGLED1.9(E)
NetR55_1: R55.1 SEGLED1.10(F)
NetR57_1: R57.1 SEGLED1.11(G)
NetR58_1: R58.1 SEGLED1.4(DOT)

Not connected (* = marked no-connect by the designer): J1 35*; RP1 3; SD_CARD1 10(CD) 11(GND) 12(WP)

### Notes on the sheet
- LED
- KEY
- 扩展IO
- BEEP
- (near J1) RGB_LCD
- SD
- LED DIGITAL TUBE
- (in symbol BEEP) +
- (in symbol CT) +

### Library data of the parts
C57 C58 = C: as C1 on sheet FPGA核心板01; 联系售后: https://shop463601444.taobao.com
E4 = CT: 贴片钽电容; 淘宝ID: 封装库来自淘宝 ID：黄晶宝石; BOM名称: 贴片钽电容; 联系售后: https://shop463601444.taobao.com
J1 = FPC-40: FPC-40P-0.5mm
LED2-LED5 = LED-SMD: 贴片LED; 版权归属: 封装库来自淘宝 ID：黄晶宝石; BOM名称: 贴片LED; 学习资源: https://shop463601444.taobao.com
LS1 = BEEP: 蜂鸣器; 版权归属: 封装库来自淘宝 ID：黄晶宝石; BOM名称: 蜂鸣器; 联系售后: https://shop463601444.taobao.com
P1 P2 = Header 24X2: Header, 24-Pin, Dual row; LatestRevisionDate: 17-Jul-2002; LatestRevisionNote: Re-released for DXP Platform.; Publisher: Altium Limited
Q1-Q6 = 8050-SMD: 高频放大-NPN型; 版权归属: 封装库来自淘宝 ID：黄晶宝石; 属性: 40V 1.5A 1W 100MHZ; BOM名称: 高频放大-NPN型; 联系售后: https://shop463601444.taobao.com
R33-R60 = R: 贴片电阻; 版权归属: 来自淘宝 ID：黄晶宝石; BOM名称: 贴片电阻; 联系售后: https://shop463601444.taobao.com
RP1 = RP: 单联电位器; BOM名称: 插件电位器; 版权归属: 封装库来自淘宝 ID：黄晶宝石; 联系售后: https://shop463601444.taobao.com
SEGLED1 = LEDSEG030-6: 6位数码管,0.3寸,共阴,41*11*5.8mm
SW2-SW6 = TSW 3x6: 3x6轻触开关; 版权归属: 封装库来自淘宝 ID：黄晶宝石; BOM名称: 3x6轻触开关; 学习资源: www.ooocke.com
V4 = AMS1117: as V1 on sheet FPGA核心板02; 欢迎光临淘宝店铺: https://shop463601444.taobao.com

## Nets that join several sheets
GND: FPGA核心板01 (66 pins), FPGA核心板02 (31 pins), FPGA核心板03 (59 pins), FPGA核心板04 (26 pins)
VCC1.2: FPGA核心板01 (15 pins), FPGA核心板02 (C36.2 E3.1 V3.2)
VCC2.5: FPGA核心板01 (7 pins), FPGA核心板02 (C34.1 E2.1 V2.2)
VCC3.3: FPGA核心板01 (46 pins), FPGA核心板02 (9 pins), FPGA核心板03 (43 pins), FPGA核心板04 (17 pins)
VCC5: FPGA核心板02 (15 pins), FPGA核心板04 (C57.1 P1.1 P2.1 V4.3)
A2: FPGA核心板01 (U1.A2), FPGA核心板03 (U6.41), FPGA核心板04 (P2.16)
A3: FPGA核心板01 (U1.A3), FPGA核心板03 (U6.43), FPGA核心板04 (P2.18)
A4: FPGA核心板01 (U1.A4), FPGA核心板03 (U6.45), FPGA核心板04 (P2.20)
A5: FPGA核心板01 (U1.A5), FPGA核心板03 (U6.47), FPGA核心板04 (P2.22)
A6: FPGA核心板01 (U1.A6), FPGA核心板03 (U6.3), FPGA核心板04 (P2.24)
A7: FPGA核心板01 (U1.A7), FPGA核心板03 (U6.5), FPGA核心板04 (P2.26)
A8: FPGA核心板01 (U1.A8), FPGA核心板03 (U6.7), FPGA核心板04 (P2.28)
A9: FPGA核心板01 (U1.A9), FPGA核心板03 (U6.9), FPGA核心板04 (P2.30)
A10: FPGA核心板01 (U1.A10), FPGA核心板03 (U6.16), FPGA核心板04 (P2.32)
A11: FPGA核心板01 (U1.A11), FPGA核心板03 (U6.18), FPGA核心板04 (P2.34)
A12: FPGA核心板01 (U1.A12), FPGA核心板03 (U6.20), FPGA核心板04 (P2.36)
A13: FPGA核心板01 (U1.A13), FPGA核心板03 (U6.22), FPGA核心板04 (P2.38)
B3: FPGA核心板01 (U1.B3), FPGA核心板03 (U6.42), FPGA核心板04 (P2.15)
B4: FPGA核心板01 (U1.B4), FPGA核心板03 (U6.44), FPGA核心板04 (P2.17)
B5: FPGA核心板01 (U1.B5), FPGA核心板03 (U6.46), FPGA核心板04 (P2.19)
B6: FPGA核心板01 (U1.B6), FPGA核心板03 (U6.48), FPGA核心板04 (P2.21)
B7: FPGA核心板01 (U1.B7), FPGA核心板03 (U6.4), FPGA核心板04 (P2.23)
B8: FPGA核心板01 (U1.B8), FPGA核心板03 (U6.6), FPGA核心板04 (P2.25)
B9: FPGA核心板01 (U1.B9), FPGA核心板03 (U6.8), FPGA核心板04 (P2.27)
B10: FPGA核心板01 (U1.B10), FPGA核心板03 (U6.10), FPGA核心板04 (P2.29)
B11: FPGA核心板01 (U1.B11), FPGA核心板03 (U6.17), FPGA核心板04 (P2.31)
B12: FPGA核心板01 (U1.B12), FPGA核心板03 (U6.19), FPGA核心板04 (P2.33)
B13: FPGA核心板01 (U1.B13), FPGA核心板03 (U6.21), FPGA核心板04 (P2.35)
BEEP: FPGA核心板01 (U1.D12), FPGA核心板04 (LS1.1)
C3: FPGA核心板01 (U1.C3), FPGA核心板03 (U6.11), FPGA核心板04 (P2.13)
C6: FPGA核心板01 (U1.C6), FPGA核心板04 (P2.37)
C8: FPGA核心板01 (U1.C8), FPGA核心板03 (U6.23), FPGA核心板04 (P2.40)
CMOS_D0: FPGA核心板01 (U1.K9), FPGA核心板02 (JP2.16)
CMOS_D1: FPGA核心板01 (U1.P8), FPGA核心板02 (JP2.15)
CMOS_D2: FPGA核心板01 (U1.N8), FPGA核心板02 (JP2.14)
CMOS_D3: FPGA核心板01 (U1.M8), FPGA核心板02 (JP2.13)
CMOS_D4: FPGA核心板01 (U1.P6), FPGA核心板02 (JP2.12)
CMOS_D5: FPGA核心板01 (U1.N6), FPGA核心板02 (JP2.11)
CMOS_D6: FPGA核心板01 (U1.R14), FPGA核心板02 (JP2.10)
CMOS_D7: FPGA核心板01 (U1.T14), FPGA核心板02 (JP2.9)
CMOS_HREF: FPGA核心板01 (U1.M9), FPGA核心板02 (JP2.6)
CMOS_PWDN: FPGA核心板01 (U1.R12), FPGA核心板02 (JP2.18)
CMOS_RESET: FPGA核心板01 (U1.L9), FPGA核心板02 (JP2.17)
CMOS_SCL: FPGA核心板01 (U1.N9), FPGA核心板02 (JP2.3)
CMOS_SDA: FPGA核心板01 (U1.L10), FPGA核心板02 (JP2.4)
CMOS_VSYNC: FPGA核心板01 (U1.P9), FPGA核心板02 (JP2.5)
COMS_PCLK: FPGA核心板01 (U1.R13), FPGA核心板02 (JP2.7)
COMS_XCLK: FPGA核心板01 (U1.T13), FPGA核心板02 (JP2.8)
D3: FPGA核心板01 (U1.D3), FPGA核心板03 (R9.1 U4.26), FPGA核心板04 (P2.11)
D4: FPGA核心板01 (U1.D4), FPGA核心板04 (P2.14)
D5: FPGA核心板01 (U1.D5), FPGA核心板04 (P2.39)
D6: FPGA核心板01 (U1.D6), FPGA核心板04 (P2.42)
D8: FPGA核心板01 (U1.D8), FPGA核心板03 (R18.2), FPGA核心板04 (P2.41)
E5: FPGA核心板01 (U1.E5), FPGA核心板03 (R10.1 U4.25), FPGA核心板04 (P2.9)
E6: FPGA核心板01 (U1.E6), FPGA核心板04 (P2.12)
E7: FPGA核心板01 (U1.E7), FPGA核心板04 (P2.44)
E8: FPGA核心板01 (U1.E8), FPGA核心板03 (R26.1), FPGA核心板04 (P2.43)
E9: FPGA核心板01 (U1.E9), FPGA核心板04 (P2.46)
E15: FPGA核心板01 (U1.E15), FPGA核心板04 (P1.47 R39.2 SW4.2)
E16: FPGA核心板01 (U1.E16), FPGA核心板04 (P1.48 R38.2 SW3.2)
ETH_RESET: FPGA核心板01 (U1.L6), FPGA核心板03 (U4.42), FPGA核心板04 (P1.17)
ETH_RXC: FPGA核心板01 (U1.L8), FPGA核心板03 (U4.16)
ETH_RXD0: FPGA核心板01 (U1.F5), FPGA核心板03 (U4.21), FPGA核心板04 (P2.7)
ETH_RXD1: FPGA核心板01 (U1.G5), FPGA核心板03 (U4.20), FPGA核心板04 (P1.7)
ETH_RXD2: FPGA核心板01 (U1.F7), FPGA核心板03 (U4.19), FPGA核心板04 (P2.45)
ETH_RXD3: FPGA核心板01 (U1.K8), FPGA核心板03 (U4.18), FPGA核心板04 (P1.12)
ETH_RXDV: FPGA核心板01 (U1.F6), FPGA核心板03 (U4.22), FPGA核心板04 (P2.10)
ETH_TXC: FPGA核心板01 (U1.J6), FPGA核心板03 (U4.7), FPGA核心板04 (P1.9)
ETH_TXD0: FPGA核心板01 (U1.K6), FPGA核心板03 (U4.6), FPGA核心板04 (P1.11)
ETH_TXD1: FPGA核心板01 (U1.K5), FPGA核心板03 (U4.5), FPGA核心板04 (P1.10)
ETH_TXD2: FPGA核心板01 (U1.L7), FPGA核心板03 (U4.4)
ETH_TXD3: FPGA核心板01 (U1.L3), FPGA核心板03 (U4.3), FPGA核心板04 (P1.15)
ETH_TXEN: FPGA核心板01 (U1.L4), FPGA核心板03 (U4.2), FPGA核心板04 (P1.16)
F1: FPGA核心板01 (U1.F1), FPGA核心板04 (J1.40 P2.6)
F2: FPGA核心板01 (U1.F2), FPGA核心板04 (J1.39 P2.5)
F3: FPGA核心板01 (U1.F3), FPGA核心板04 (P2.8)
F8: FPGA核心板01 (U1.F8), FPGA核心板03 (R25.1), FPGA核心板04 (P2.48)
F10: FPGA核心板01 (U1.F10), FPGA核心板04 (P2.47)
G1: FPGA核心板01 (U1.G1), FPGA核心板04 (J1.38 P1.5)
G2: FPGA核心板01 (U1.G2), FPGA核心板04 (J1.37 P1.6)
J1: FPGA核心板01 (U1.J1), FPGA核心板04 (J1.34 P1.8)
KEY2: FPGA核心板01 (U1.M2), FPGA核心板04 (R40.2 SW5.2)
KEY3: FPGA核心板01 (U1.M16), FPGA核心板04 (R41.2 SW6.2)
L1: FPGA核心板01 (U1.L1), FPGA核心板04 (J1.33 P1.13)
L2: FPGA核心板01 (U1.L2), FPGA核心板04 (J1.32 P1.14)
LCD_B0: FPGA核心板01 (U1.T3), FPGA核心板04 (J1.21 P1.27)
LCD_B1: FPGA核心板01 (U1.R3), FPGA核心板04 (J1.22 P1.28)
LCD_B2: FPGA核心板01 (U1.P3), FPGA核心板04 (J1.23 P1.24)
LCD_B3: FPGA核心板01 (U1.N3), FPGA核心板04 (J1.24 P1.21)
LCD_B4: FPGA核心板01 (U1.T2), FPGA核心板04 (J1.25 P1.26)
LCD_B5: FPGA核心板01 (U1.R1), FPGA核心板04 (J1.26 P1.25)
LCD_B6: FPGA核心板01 (U1.P2), FPGA核心板04 (J1.27 P1.23)
LCD_B7: FPGA核心板01 (U1.P1), FPGA核心板04 (J1.28 P1.22)
LCD_CLK: FPGA核心板01 (U1.N2), FPGA核心板04 (J1.30 P1.20)
LCD_DISP: FPGA核心板01 (U1.N1), FPGA核心板04 (J1.31 P1.19)
LCD_G0: FPGA核心板01 (U1.T7), FPGA核心板04 (J1.13 P1.35)
LCD_G1: FPGA核心板01 (U1.R7), FPGA核心板04 (J1.14 P1.36)
LCD_G2: FPGA核心板01 (U1.T6), FPGA核心板04 (J1.15 P1.33)
LCD_G3: FPGA核心板01 (U1.R6), FPGA核心板04 (J1.16 P1.34)
LCD_G4: FPGA核心板01 (U1.T5), FPGA核心板04 (J1.17 P1.31)
LCD_G5: FPGA核心板01 (U1.R5), FPGA核心板04 (J1.18 P1.32)
LCD_G6: FPGA核心板01 (U1.T4), FPGA核心板04 (J1.19 P1.29)
LCD_G7: FPGA核心板01 (U1.R4), FPGA核心板04 (J1.20 P1.30)
LCD_R0: FPGA核心板01 (U1.T11), FPGA核心板04 (J1.5 P1.43)
LCD_R1: FPGA核心板01 (U1.R11), FPGA核心板04 (J1.6 P1.44)
LCD_R2: FPGA核心板01 (U1.T10), FPGA核心板04 (J1.7 P1.41)
LCD_R3: FPGA核心板01 (U1.R10), FPGA核心板04 (J1.8 P1.42)
LCD_R4: FPGA核心板01 (U1.T9), FPGA核心板04 (J1.9 P1.39)
LCD_R5: FPGA核心板01 (U1.R9), FPGA核心板04 (J1.10 P1.40)
LCD_R6: FPGA核心板01 (U1.T8), FPGA核心板04 (J1.11 P1.37)
LCD_R7: FPGA核心板01 (U1.R8), FPGA核心板04 (J1.12 P1.38)
LED0: FPGA核心板01 (U1.D11), FPGA核心板04 (LED2.1)
LED1: FPGA核心板01 (U1.C11), FPGA核心板04 (LED3.1)
LED2: FPGA核心板01 (U1.E10), FPGA核心板04 (LED4.1)
LED3: FPGA核心板01 (U1.F9), FPGA核心板04 (LED5.1)
LEDSEG_A: FPGA核心板01 (U1.M11), FPGA核心板04 (R42.2)
LEDSEG_B: FPGA核心板01 (U1.N12), FPGA核心板04 (R44.2)
LEDSEG_C: FPGA核心板01 (U1.C9), FPGA核心板04 (R47.2)
LEDSEG_CH1: FPGA核心板01 (U1.T15), FPGA核心板04 (R43.2)
LEDSEG_CH2: FPGA核心板01 (U1.R16), FPGA核心板04 (R46.2)
LEDSEG_CH3: FPGA核心板01 (U1.P15), FPGA核心板04 (R49.2)
LEDSEG_CH4: FPGA核心板01 (U1.P16), FPGA核心板04 (R52.2)
LEDSEG_CH5: FPGA核心板01 (U1.N15), FPGA核心板04 (R54.2)
LEDSEG_CH6: FPGA核心板01 (U1.N16), FPGA核心板04 (R56.2)
LEDSEG_D: FPGA核心板01 (U1.N13), FPGA核心板04 (R50.2)
LEDSEG_DOT: FPGA核心板01 (U1.D9), FPGA核心板04 (R58.2)
LEDSEG_E: FPGA核心板01 (U1.M10), FPGA核心板04 (R53.2)
LEDSEG_F: FPGA核心板01 (U1.N11), FPGA核心板04 (R55.2)
LEDSEG_G: FPGA核心板01 (U1.P11), FPGA核心板04 (R57.2)
M6: FPGA核心板01 (U1.M6), FPGA核心板04 (P1.18)
M15: FPGA核心板01 (U1.M15), FPGA核心板04 (P1.46)
RESET: FPGA核心板01 (U1.M1), FPGA核心板04 (R37.2 SW2.2)
SDIO_CMD: FPGA核心板01 (U1.D1), FPGA核心板04 (R51.2 SD_CARD1.2)
SDIO_D0: FPGA核心板01 (U1.K1), FPGA核心板04 (R59.2 SD_CARD1.7)
SDIO_D1: FPGA核心板01 (U1.K2), FPGA核心板04 (R60.2 SD_CARD1.8)
SDIO_D2: FPGA核心板01 (U1.B1), FPGA核心板04 (R45.2 SD_CARD1.9)
SDIO_D3: FPGA核心板01 (U1.C2), FPGA核心板04 (R48.2 SD_CARD1.1)
SDIO_SCK: FPGA核心板01 (U1.J2), FPGA核心板04 (SD_CARD1.5)
SDRAM_A0: FPGA核心板01 (U1.F11), FPGA核心板03 (U5.23)
SDRAM_A1: FPGA核心板01 (U1.E11), FPGA核心板03 (U5.24)
SDRAM_A2: FPGA核心板01 (U1.D14), FPGA核心板03 (U5.25)
SDRAM_A3: FPGA核心板01 (U1.C14), FPGA核心板03 (U5.26)
SDRAM_A4: FPGA核心板01 (U1.A14), FPGA核心板03 (U5.29)
SDRAM_A5: FPGA核心板01 (U1.A15), FPGA核心板03 (U5.30)
SDRAM_A6: FPGA核心板01 (U1.B16), FPGA核心板03 (U5.31)
SDRAM_A7: FPGA核心板01 (U1.C15), FPGA核心板03 (U5.32)
SDRAM_A8: FPGA核心板01 (U1.C16), FPGA核心板03 (U5.33)
SDRAM_A9: FPGA核心板01 (U1.D15), FPGA核心板03 (U5.34)
SDRAM_A10: FPGA核心板01 (U1.F14), FPGA核心板03 (U5.22)
SDRAM_A11: FPGA核心板01 (U1.D16), FPGA核心板03 (U5.35)
SDRAM_A12: FPGA核心板01 (U1.F15), FPGA核心板03 (U5.36)
SDRAM_BA0: FPGA核心板01 (U1.G11), FPGA核心板03 (U5.20)
SDRAM_BA1: FPGA核心板01 (U1.F13), FPGA核心板03 (U5.21)
SDRAM_CAS: FPGA核心板01 (U1.J12), FPGA核心板03 (U5.17)
SDRAM_CKE: FPGA核心板01 (U1.F16), FPGA核心板03 (U5.37)
SDRAM_CLK: FPGA核心板01 (U1.B14), FPGA核心板03 (U5.38)
SDRAM_CS: FPGA核心板01 (U1.K10), FPGA核心板03 (U5.19)
SDRAM_D0: FPGA核心板01 (U1.P14), FPGA核心板03 (U5.2)
SDRAM_D1: FPGA核心板01 (U1.M12), FPGA核心板03 (U5.4)
SDRAM_D2: FPGA核心板01 (U1.N14), FPGA核心板03 (U5.5)
SDRAM_D3: FPGA核心板01 (U1.L12), FPGA核心板03 (U5.7)
SDRAM_D4: FPGA核心板01 (U1.L13), FPGA核心板03 (U5.8)
SDRAM_D5: FPGA核心板01 (U1.L14), FPGA核心板03 (U5.10)
SDRAM_D6: FPGA核心板01 (U1.L11), FPGA核心板03 (U5.11)
SDRAM_D7: FPGA核心板01 (U1.K12), FPGA核心板03 (U5.13)
SDRAM_D8: FPGA核心板01 (U1.G16), FPGA核心板03 (U5.42)
SDRAM_D9: FPGA核心板01 (U1.J11), FPGA核心板03 (U5.44)
SDRAM_D10: FPGA核心板01 (U1.J16), FPGA核心板03 (U5.45)
SDRAM_D11: FPGA核心板01 (U1.J15), FPGA核心板03 (U5.47)
SDRAM_D12: FPGA核心板01 (U1.K16), FPGA核心板03 (U5.48)
SDRAM_D13: FPGA核心板01 (U1.K15), FPGA核心板03 (U5.50)
SDRAM_D14: FPGA核心板01 (U1.L16), FPGA核心板03 (U5.51)
SDRAM_D15: FPGA核心板01 (U1.L15), FPGA核心板03 (U5.53)
SDRAM_DQM0: FPGA核心板01 (U1.J14), FPGA核心板03 (U5.15)
SDRAM_DQM1: FPGA核心板01 (U1.G15), FPGA核心板03 (U5.39)
SDRAM_RAS: FPGA核心板01 (U1.K11), FPGA核心板03 (U5.18)
SDRAM_WE: FPGA核心板01 (U1.J13), FPGA核心板03 (U5.16)
T12: FPGA核心板01 (U1.T12), FPGA核心板04 (P1.45)
UART_RX: FPGA核心板01 (U1.N5), FPGA核心板02 (U3.2)
UART_TX: FPGA核心板01 (U1.M7), FPGA核心板02 (U3.3)